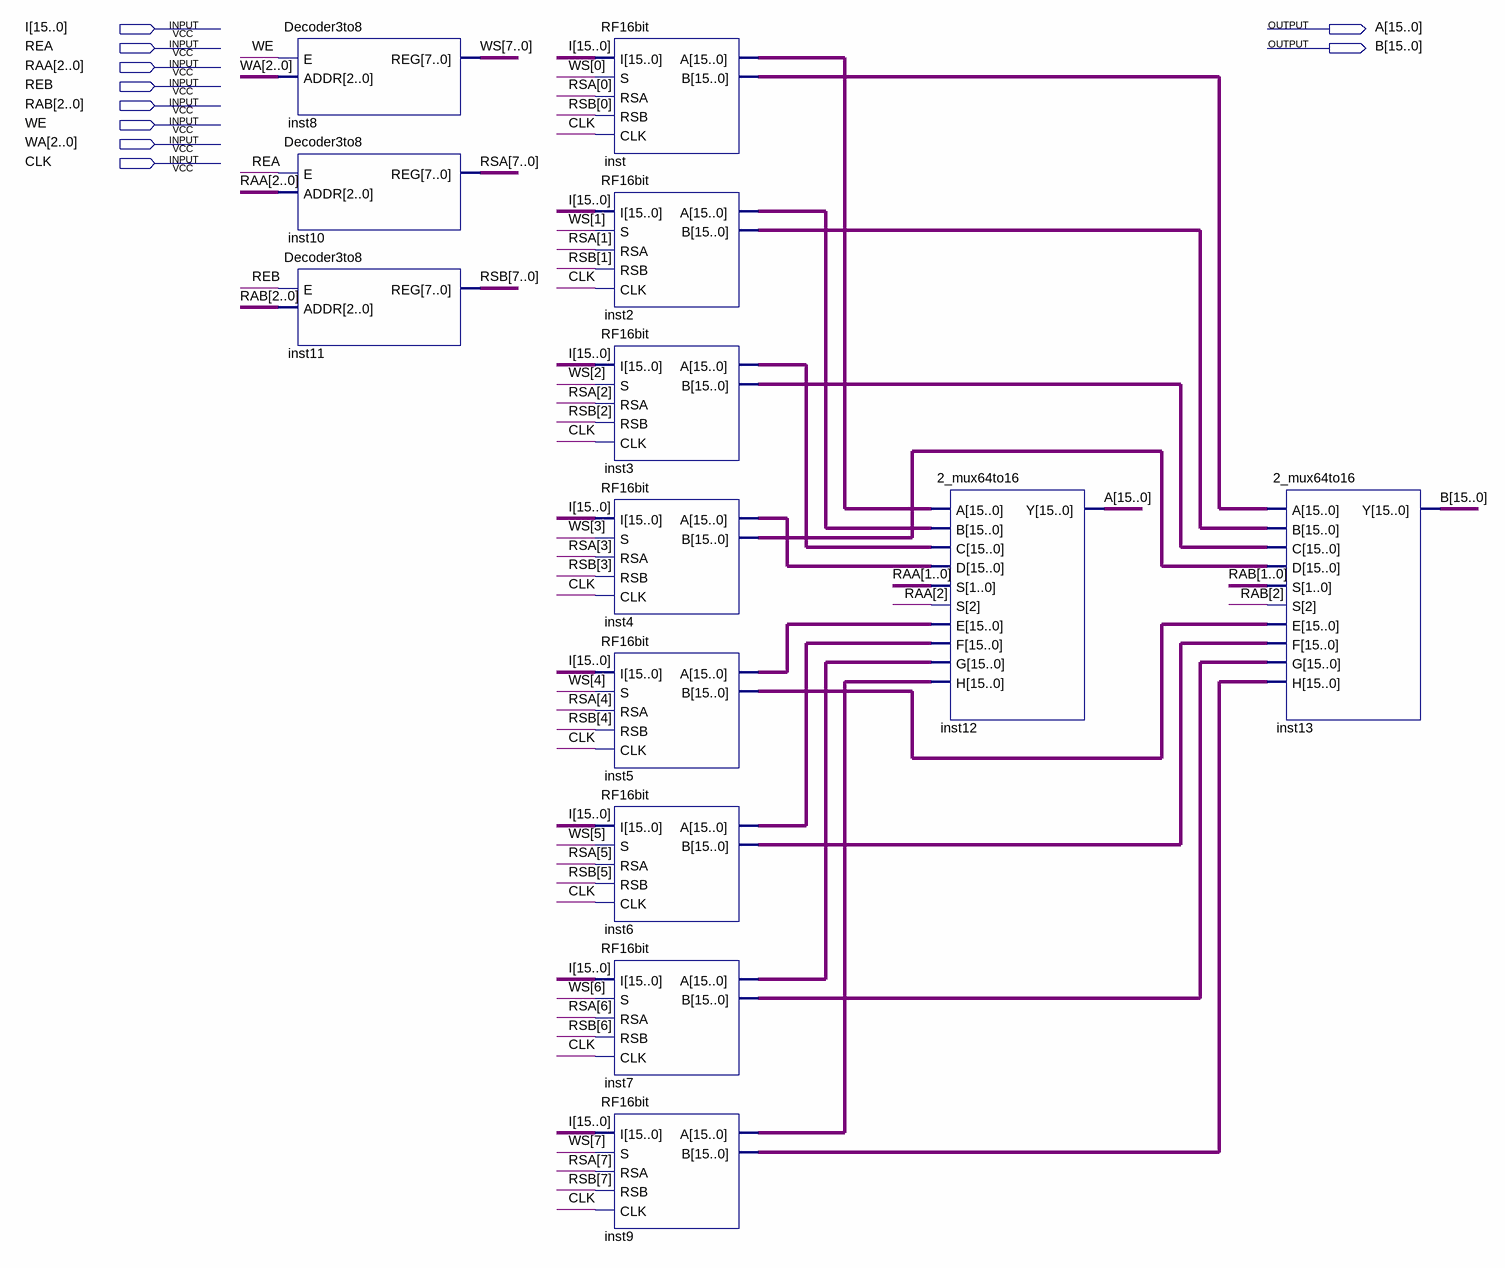
[diagram p0: schematic sheet]
// Quartus schematic 8_16bitsregisterfile.bdf as structural Verilog: 13 symbols, 10 pins
module \8_16bitsregisterfile  (
  input  [15:0] I,
  input  REA,
  input  [2:0] RAA,
  input  REB,
  input  [2:0] RAB,
  input  WE,
  input  [2:0] WA,
  input  CLK,
  output [15:0] A,
  output [15:0] B
);

  wire [7:0] RSA, RSB, WS;
  wire [15:0] inst2_a, inst2_b, inst3_a, inst3_b, inst4_a, inst4_b, inst5_a, inst5_b, inst6_a, inst6_b,
       inst7_a, inst7_b, inst9_a, inst9_b, inst_a, inst_b;

  Decoder3to8 inst8 (.E(WE), .ADDR(WA), .REG(WS));
  Decoder3to8 inst10 (.E(REA), .ADDR(RAA), .REG(RSA));
  Decoder3to8 inst11 (.E(REB), .ADDR(RAB), .REG(RSB));
  RF16bit inst (.I(I), .S(WS[0]), .RSA(RSA[0]), .RSB(RSB[0]), .CLK(CLK), .A(inst_a), .B(inst_b));
  RF16bit inst2 (.I(I), .S(WS[1]), .RSA(RSA[1]), .RSB(RSB[1]), .CLK(CLK), .A(inst2_a), .B(inst2_b));
  RF16bit inst3 (.I(I), .S(WS[2]), .RSA(RSA[2]), .RSB(RSB[2]), .CLK(CLK), .A(inst3_a), .B(inst3_b));
  RF16bit inst4 (.I(I), .S(WS[3]), .RSA(RSA[3]), .RSB(RSB[3]), .CLK(CLK), .A(inst4_a), .B(inst4_b));
  RF16bit inst5 (.I(I), .S(WS[4]), .RSA(RSA[4]), .RSB(RSB[4]), .CLK(CLK), .A(inst5_a), .B(inst5_b));
  RF16bit inst6 (.I(I), .S(WS[5]), .RSA(RSA[5]), .RSB(RSB[5]), .CLK(CLK), .A(inst6_a), .B(inst6_b));
  RF16bit inst7 (.I(I), .S(WS[6]), .RSA(RSA[6]), .RSB(RSB[6]), .CLK(CLK), .A(inst7_a), .B(inst7_b));
  RF16bit inst9 (.I(I), .S(WS[7]), .RSA(RSA[7]), .RSB(RSB[7]), .CLK(CLK), .A(inst9_a), .B(inst9_b));
  \2_mux64to16  inst12 (
    .A(inst_a), .B(inst2_a), .C(inst3_a), .D(inst4_a), .S(RAA), .E(inst5_a), .F(inst6_a), .G(inst7_a),
    .H(inst9_a), .Y(A));
  \2_mux64to16  inst13 (
    .A(inst_b), .B(inst2_b), .C(inst3_b), .D(inst4_b), .S(RAB), .E(inst5_b), .F(inst6_b), .G(inst7_b),
    .H(inst9_b), .Y(B));
endmodule
